# Altium schematic sheet Sheet1.SchDoc
size A2; SheetNumber: 1; SheetTotal: 1
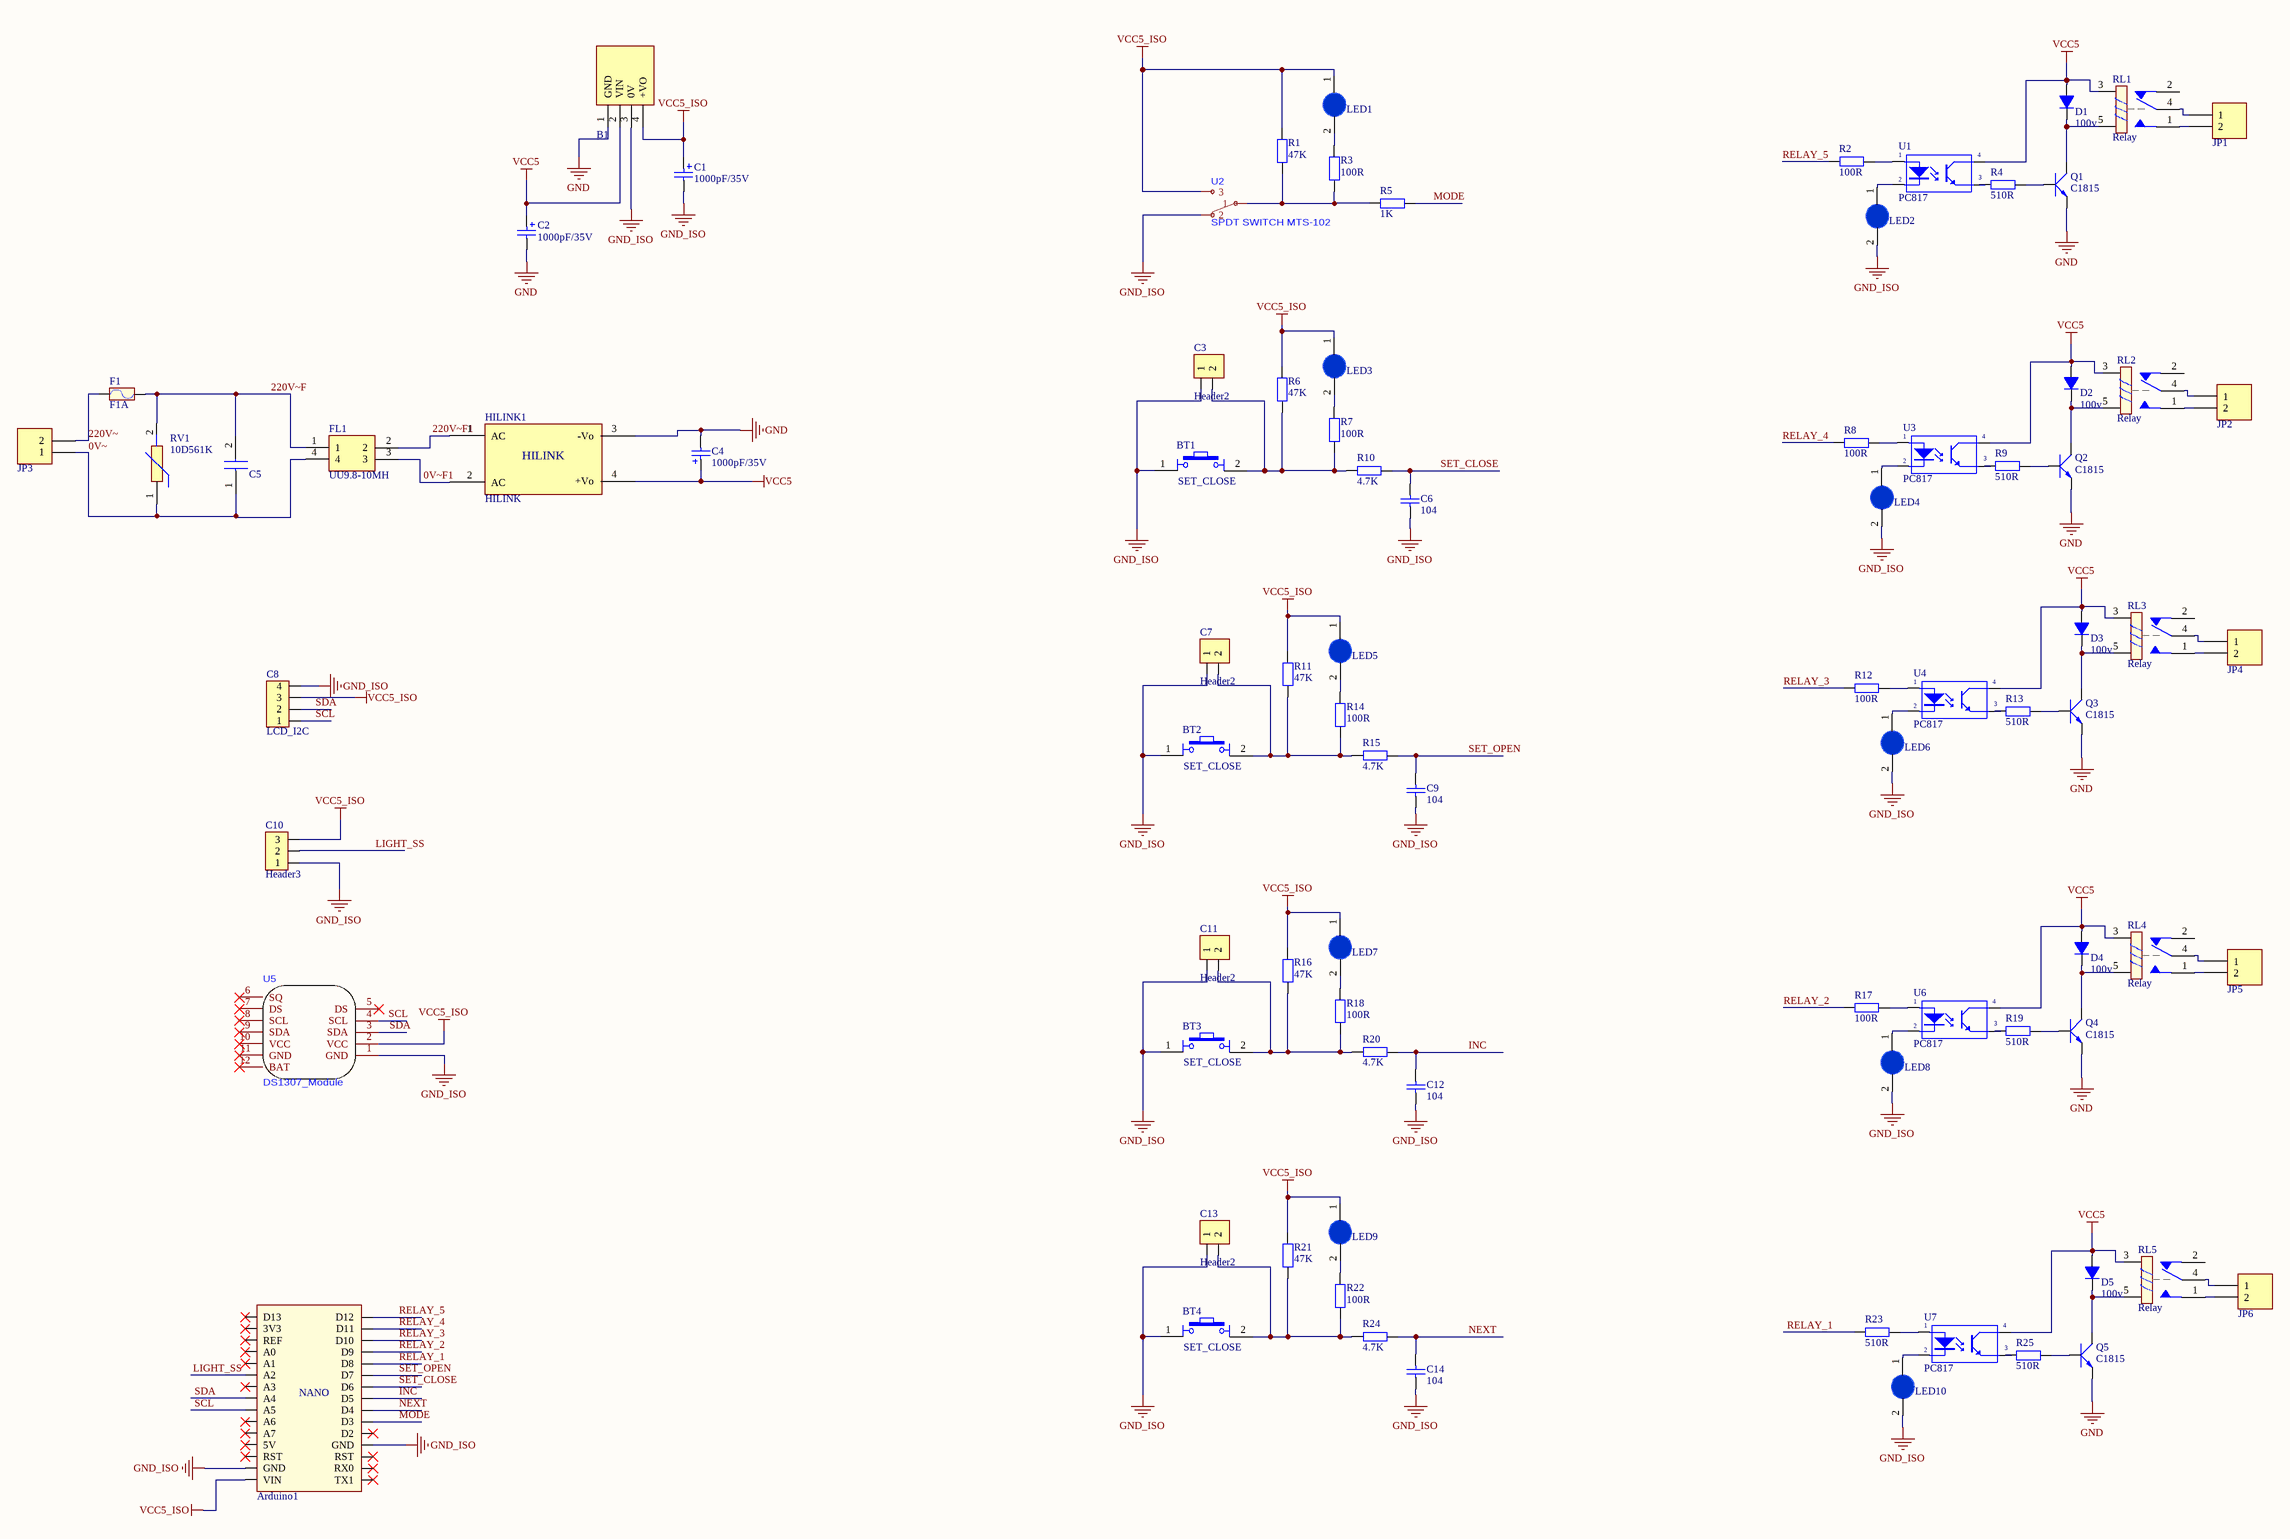
[diagram p0: Sheet1.SchDoc]

## Parts
Arduino1  Arduino Nano  [Arduino Nano]  (value not drawn)
B1  B0505S1W  [B0505S1W]  (value not drawn)
BT1  SET_CLOSE  [Nut Nhan 4 Chan Cam 6x6]
BT2  SET_CLOSE  [Nut Nhan 4 Chan Cam 6x6]
BT3  SET_CLOSE  [Nut Nhan 4 Chan Cam 6x6]
BT4  SET_CLOSE  [Nut Nhan 4 Chan Cam 6x6]
C1  value 1000pF/35V  [CP2/5]  (hidden comment: Cap Pol3)
C2  value 1000pF/35V  [CP2/5]  (hidden comment: Cap Pol3)
C3  Header2  [Header2]
C4  value 1000pF/35V  [CP2/5]  (hidden comment: Cap Pol3)
C5  R46KF3100JMP0K  [R46KF3100JMP0K]  (value not drawn)
C6  104  [tu gom]
C7  Header2  [Header2]
C8  LCD_I2C  [Header4]
C9  104  [tu gom]
C10  Header3  [Header3]
C11  Header2  [Header2]
C12  104  [tu gom]
C13  Header2  [Header2]
C14  104  [tu gom]
D1  100v  [DIODE 0.5A]
D2  100v  [DIODE 0.5A]
D3  100v  [DIODE 0.5A]
D4  100v  [DIODE 0.5A]
D5  100v  [DIODE 0.5A]
F1  F1A  [Fuse]
FL1  UU9.8-10MH  [UU9810MH]
HILINK1  HILINK  [HILINK_1W]
JP1  Header 2_1  [HED2]  (value not drawn)
JP2  Header 2_1  [HED2]  (value not drawn)
JP3  Header 2_1  [HED2]  (value not drawn)
JP4  Header 2_1  [HED2]  (value not drawn)
JP5  Header 2_1  [HED2]  (value not drawn)
JP6  Header 2_1  [HED2]  (value not drawn)
LED1  LED 3mm  [LED-3MM-BLUE]  (value not drawn)
LED2  LED 3mm  [LED-3MM-BLUE]  (value not drawn)
LED3  LED 3mm  [LED-3MM-BLUE]  (value not drawn)
LED4  LED 3mm  [LED-3MM-BLUE]  (value not drawn)
LED5  LED 3mm  [LED-3MM-BLUE]  (value not drawn)
LED6  LED 3mm  [LED-3MM-BLUE]  (value not drawn)
LED7  LED 3mm  [LED-3MM-BLUE]  (value not drawn)
LED8  LED 3mm  [LED-3MM-BLUE]  (value not drawn)
LED9  LED 3mm  [LED-3MM-BLUE]  (value not drawn)
LED10  LED 3mm  [LED-3MM-BLUE]  (value not drawn)
Q1  C1815  [C1815_cam]
Q2  C1815  [C1815_cam]
Q3  C1815  [C1815_cam]
Q4  C1815  [C1815_cam]
Q5  C1815  [C1815_cam]
R1  47K  [R1/4W]
R2  100R  [R1/4W]
R3  100R  [R1/4W]
R4  510R  [R1/4W]
R5  1K  [R1/4W]
R6  47K  [R1/4W]
R7  100R  [R1/4W]
R8  100R  [R1/4W]
R9  510R  [R1/4W]
R10  4.7K  [R1/4W]
R11  47K  [R1/4W]
R12  100R  [R1/4W]
R13  510R  [R1/4W]
R14  100R  [R1/4W]
R15  4.7K  [R1/4W]
R16  47K  [R1/4W]
R17  100R  [R1/4W]
R18  100R  [R1/4W]
R19  510R  [R1/4W]
R20  4.7K  [R1/4W]
R21  47K  [R1/4W]
R22  100R  [R1/4W]
R23  510R  [R1/4W]
R24  4.7K  [R1/4W]
R25  510R  [R1/4W]
RL1  Relay  [RELAY_SRA_05VDC_CL]
RL2  Relay  [RELAY_SRA_05VDC_CL]
RL3  Relay  [RELAY_SRA_05VDC_CL]
RL4  Relay  [RELAY_SRA_05VDC_CL]
RL5  Relay  [RELAY_SRA_05VDC_CL]
RV1  10D561K  [10D561K]
U1  PC817  [DIP4/W0.3]
U2  SPDT SWITCH MTS-102  [SPDT SWITCH  MTS-102]
U3  PC817  [DIP4/W0.3]
U4  PC817  [DIP4/W0.3]
U5  DS1307_Module  [DS1307 MODULE]
U6  PC817  [DIP4/W0.3]
U7  PC817  [DIP4/W0.3]

## Nets
GND: B1.1(GND) C2.2 C4.2 HILINK1.3(-Vo) Q1.1(E) Q2.1(E) Q3.1(E) Q4.1(E) Q5.1(E)
GND_ISO: Arduino1.GND B1.3(0V) BT1.1 BT2.1 BT3.1 BT4.1 C1.2 C3.1 C6.2 C7.1 C8.4 C9.2 C10.1 C11.1 C12.2 C13.1 C14.2 LED2.2(K) LED4.2(K) LED6.2(K) LED8.2(K) LED10.2(K) U2.2 U5.1(GND)
VCC5: B1.2(VIN) C2.1 C4.1 D1.1(A) D2.1(A) D3.1(A) D4.1(A) D5.1(A) HILINK1.4(+Vo) RL1.3 RL2.3 RL3.3 RL4.3 RL5.3 U1.4(C) U3.4(C) U4.4(C) U6.4(C) U7.4(C)
VCC5_ISO: Arduino1.VIN B1.4(+VO) C1.1 C8.3 C10.3 LED1.1(A) LED3.1(A) LED5.1(A) LED7.1(A) LED9.1(A) R1.2 R6.2 R11.2 R16.2 R21.2 U2.3 U5.2(VCC)
0V~: C5.1 FL1.4 JP3.1 RV1.1
0V~F1: FL1.3 HILINK1.2(AC)
220V~: F1.1 JP3.2
220V~F: C5.2 F1.2 FL1.1 RV1.2
220V~F1: FL1.2 HILINK1.1(AC)
INC: Arduino1.D5 C12.1 R20.1
LIGHT_SS: Arduino1.A2 C10.2
MODE: Arduino1.D3 R5.1
NEXT: Arduino1.D4 C14.1 R24.1
RELAY_1: Arduino1.D8 R23.1
RELAY_2: Arduino1.D9 R17.1
RELAY_3: Arduino1.D10 R12.1
RELAY_4: Arduino1.D11 R8.1
RELAY_5: Arduino1.D12 R2.1
SCL: Arduino1.A5 C8.1 U5.4(SCL)
SDA: Arduino1.A4 C8.2 U5.3(SDA)
SET_CLOSE: Arduino1.D6 C6.1 R10.1
SET_OPEN: Arduino1.D7 C9.1 R15.1
NetBT1_2: BT1.2 C3.2 R6.1 R7.1 R10.2
NetBT2_2: BT2.2 C7.2 R11.1 R14.1 R15.2
NetBT3_2: BT3.2 C11.2 R16.1 R18.1 R20.2
NetBT4_2: BT4.2 C13.2 R21.1 R22.1 R24.2
NetD1_2: D1.2(K) Q1.2(C) RL1.5
NetD2_2: D2.2(K) Q2.2(C) RL2.5
NetD3_2: D3.2(K) Q3.2(C) RL3.5
NetD4_2: D4.2(K) Q4.2(C) RL4.5
NetD5_2: D5.2(K) Q5.2(C) RL5.5
NetJP1_1: JP1.1 RL1.4
NetJP1_2: JP1.2 RL1.1
NetJP2_1: JP2.1 RL2.4
NetJP2_2: JP2.2 RL2.1
NetJP4_1: JP4.1 RL3.4
NetJP4_2: JP4.2 RL3.1
NetJP5_1: JP5.1 RL4.4
NetJP5_2: JP5.2 RL4.1
NetJP6_1: JP6.1 RL5.4
NetJP6_2: JP6.2 RL5.1
NetLED1_2: LED1.2(K) R3.2
NetLED2_1: LED2.1(A) U1.2(K)
NetLED3_2: LED3.2(K) R7.2
NetLED4_1: LED4.1(A) U3.2(K)
NetLED5_2: LED5.2(K) R14.2
NetLED6_1: LED6.1(A) U4.2(K)
NetLED7_2: LED7.2(K) R18.2
NetLED8_1: LED8.1(A) U6.2(K)
NetLED9_2: LED9.2(K) R22.2
NetLED10_1: LED10.1(A) U7.2(K)
NetQ1_3: Q1.3(B) R4.2
NetQ2_3: Q2.3(B) R9.2
NetQ3_3: Q3.3(B) R13.2
NetQ4_3: Q4.3(B) R19.2
NetQ5_3: Q5.3(B) R25.2
NetR1_1: R1.1 R3.1 R5.2 U2.1
NetR2_2: R2.2 U1.1(A)
NetR4_1: R4.1 U1.3(E)
NetR8_2: R8.2 U3.1(A)
NetR9_1: R9.1 U3.3(E)
NetR12_2: R12.2 U4.1(A)
NetR13_1: R13.1 U4.3(E)
NetR17_2: R17.2 U6.1(A)
NetR19_1: R19.1 U6.3(E)
NetR23_2: R23.2 U7.1(A)
NetR25_1: R25.1 U7.3(E)

Not connected (* = marked no-connect by the designer): Arduino1 3V3* 5V* A0* A1* A3* A6* A7* D2* D13* REF* RST* RX0* TX1*; RL1 2; RL2 2; RL3 2; RL4 2; RL5 2; U5 5(DS)* 6(SQ)* 7(DS)* 8(SCL)* 9(SDA)* 10(VCC)* 11(GND)* 12(BAT)*

## Notes on the sheet
- (in symbol Arduino Nano) NANO

## Library data of the parts
Arduino1 = Arduino Nano: Value: Cau 1A
B1 = B0505S1W: Power Supply; Manufacturer_Name: Mornsun; Manufacturer_Part_Number: B0505S-1W; Datasheet Link: https://www.mornsun-power.com/uploads/pdf/B_D-1W.pdf; Height: 10.41mm
BT1-BT4 = Nut Nhan 4 Chan Cam 6x6: Nut Nhan 4 Chan 6x6mm; Ten: Nút Nhấn 4 Chân 6x6x5MM DIP; Ma_Hang: MH004584
C1 C2 C4 = Cap Pol3: Polarized Capacitor (Surface Mount); VALUE: C?; LatestRevisionDate: 17-Jul-2002; LatestRevisionNote: Re-released for DXP Platform.; PackageReference: C0805; Publisher: Altium Limited
C3 C7 C11 C13 = Header2: Header IDC, 2 x 1 Pin Vertical 2.54mm Pitch (Non-Boxed, Male); Manufacturer: W¨¹rth Elektronik eiSos GmbH; partNo: 613002143121; ComponentLink1 Description: Manufacturer; ComponentLink2 Description: Datasheet; NoPins: 02; Created Date: 29 March 2013; ComponentLink1URL: http://www.we-online.com; ComponentLink2URL: http://katalog.we-online.de/em/datasheet/6130xx143121.pdf; Created by: Karrer Zheng
C5 = R46KF3100JMP0K: Capacitor; Manufacturer_Name: Kemet; Datasheet Link: https://api.kemet.com/component-edge/download/specsheet/R46KF3100JMP0K.pdf; Height: 12.1mm; Manufacturer_Part_Number: R46KF3100JMP0K; Mouser Part Number: 80-R46KF3100JMP0K; Mouser Price/Stock: https://www.mouser.co.uk/ProductDetail/KEMET/R46KF3100JMP0K/?qs=gt1LBUVyoHk5JqGpZKIGRw%3D%3D
C6 C9 C12 C14 = Tu gom 104 50V: Cắm; So_Chan: 2; Ten_Linh_Kien: Tụ gốm 104 100nF 50V; Don_Vi: Con; Ma_Hang: MH004761; Chung_Loai: Cắm; Kieu_Chan: *
C8 = Header4: Header IDC, 4 x 1 Pin Vertical 2.54mm Pitch (Non-Boxed, Male); Manufacturer: W¨¹rth Elektronik eiSos GmbH; partNo: 613002143121; ComponentLink1 Description: Manufacturer; ComponentLink2 Description: Datasheet; NoPins: 02; Created Date: 29 March 2013; ComponentLink1URL: http://www.we-online.com; ComponentLink2URL: http://katalog.we-online.de/em/datasheet/6130xx143121.pdf; Created by: Karrer Zheng
C10 = Header3: Header IDC, 3 x 1 Pin Vertical 2.54mm Pitch (Non-Boxed, Male); Manufacturer: W¨¹rth Elektronik eiSos GmbH; partNo: 613002143121; ComponentLink1 Description: Manufacturer; ComponentLink2 Description: Datasheet; NoPins: 02; Created Date: 29 March 2013; ComponentLink1URL: http://www.we-online.com; ComponentLink2URL: http://katalog.we-online.de/em/datasheet/6130xx143121.pdf; Created by: Karrer Zheng
D1-D5 = Diode 1N4148: Cắm; Ten_Linh_Kien: Diode 1N4148 DO35 450mA 100V ( 1N4148 DIP); Don_Vi: Con; Ma_Hang: MH001065; Ghi Chu: *; Kieu_Chan: *; Chung_Loai: Cắm
F1 = Fuse: Designed by: VanDungEvn; Value: Fuse
FL1 = UU9.8-10MH: Filter; Manufacturer_Name: Guangdong Fenghua Advanced Tech; Datasheet Link: https://datasheet.lcsc.com/szlcsc/1811111206_Guangdong-Fenghua-Advanced-Tech-UU9-8-10mH_C148474.pdf; Height: 17mm; Manufacturer_Part_Number: UU9.8-10MH
JP1-JP6 = Header 2_1: Header, 2-Pin; Manufacturer: Generic Components; Class: Connector; Value: Header 2
LED1-LED10 = LED 3mm Xanh Duong: Cắm; Don_Vi: Con; Ma_Hang: MH009003; Ten_Linh_Kien: LED 3MM Xanh Dương SS (1000c); Ghi_Chu: *; Kieu_Chan: *; Chung_Loai: Cắm
Q1-Q5 = C1815: NPN 600mW, ECB; Value: C1815
R1-R25 = R1/4W: Resistor 1/4W; Value: R1/4W - 1K
RL1-RL5 = RL_SRA-05VDC-CL: Relay 5 Chan; Ma_Hang: MH009374; Ten: Relay 5V10A SRD-05VDC-SL-C Chính Hãng
RV1 = 10D561K: Varistor; Manufacturer_Name: Bourns; Manufacturer_Part_Number: MOV-10D561K; Datasheet Link: https://www.bourns.com/docs/Product-Datasheets/MOV10D.pdf; Height: 15.5mm; Mouser Part Number: 652-MOV-10D561K; Mouser Price/Stock: https://www.mouser.co.uk/ProductDetail/Bourns/MOV-10D561K?qs=lgttKnAd%252B2ArrqGQgWwr6w%3D%3D; Arrow Part Number: MOV-10D561K; Arrow Price/Stock: https://www.arrow.com/en/products/mov-10d561k/bourns
U1 U3 U4 U6 U7 = PC817: Single Opto; Value: PC817